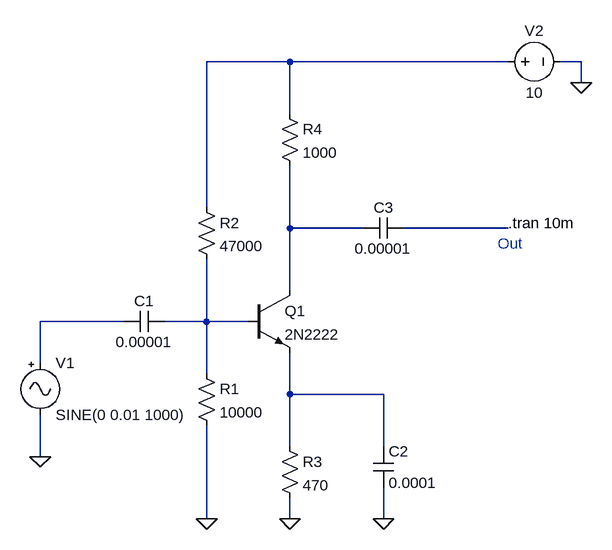
[diagram p0: schematic Circuito1.asc]
Circuito1.asc, the LTspice schematic file:
Version 4.1
SHEET 1 880 680
WIRE 96 -496 -32 -496
WIRE 432 -496 96 -496
WIRE 544 -496 512 -496
WIRE 544 -464 544 -496
WIRE 96 -416 96 -496
WIRE -32 -272 -32 -496
WIRE 96 -240 96 -336
WIRE 208 -240 96 -240
WIRE 432 -240 272 -240
WIRE 96 -144 96 -240
WIRE -160 -96 -288 -96
WIRE -32 -96 -32 -192
WIRE -32 -96 -96 -96
WIRE 32 -96 -32 -96
WIRE -288 -32 -288 -96
WIRE -32 -16 -32 -96
WIRE 96 16 96 -48
WIRE 240 16 96 16
WIRE 96 96 96 16
WIRE 240 96 240 16
WIRE -288 112 -288 48
WIRE -32 208 -32 64
WIRE 96 208 96 176
WIRE 240 208 240 160
FLAG -288 112 0
FLAG -32 208 0
FLAG 96 208 0
FLAG 240 208 0
FLAG 544 -464 0
SYMBOL Misc\\signal -288 -48 R0
WINDOW 123 0 0 Left 0
WINDOW 39 0 0 Left 0
SYMATTR InstName V1
SYMATTR Value SINE(0 0.01 1000)
SYMBOL cap -96 -112 R90
WINDOW 0 0 32 VBottom 2
WINDOW 3 32 32 VTop 2
SYMATTR InstName C1
SYMATTR Value 0.00001
SYMBOL npn 32 -144 R0
SYMATTR InstName Q1
SYMATTR Value 2N2222
SYMBOL res -48 -32 R0
SYMATTR InstName R1
SYMATTR Value 10000
SYMBOL res -48 -288 R0
SYMATTR InstName R2
SYMATTR Value 47000
SYMBOL cap 224 96 R0
SYMATTR InstName C2
SYMATTR Value 0.0001
SYMBOL res 80 80 R0
SYMATTR InstName R3
SYMATTR Value 470
SYMBOL res 80 -432 R0
SYMATTR InstName R4
SYMATTR Value 1000
SYMBOL cap 272 -256 R90
WINDOW 0 0 32 VBottom 2
WINDOW 3 32 32 VTop 2
SYMATTR InstName C3
SYMATTR Value 0.00001
SYMBOL voltage 416 -496 R270
WINDOW 0 32 56 VTop 2
WINDOW 3 -32 56 VBottom 2
WINDOW 123 0 0 Left 0
WINDOW 39 0 0 Left 0
SYMATTR InstName V2
SYMATTR Value 10
TEXT 416 -216 Left 2 ;Out
TEXT 432 -248 Left 2 !.tran 10m

The netlist it stands for:
* Circuito1.asc
V1 N004 0 SINE(0 0.01 1000)
C1 N005 N004 0.00001
Q1 N002 N005 N006 0 2N2222
R1 N005 0 10000
R2 N001 N005 47000
C2 N006 0 0.0001
R3 N006 0 470
R4 N001 N002 1000
C3 N003 N002 0.00001
V2 N001 0 10
.model NPN NPN
.model PNP PNP
.lib standard.bjt
* Out
.tran 10m
.backanno
.end